# Altium project obc_ver111.PrjPcb (part 2 of 2)

## Sheet obc-v2_MCU-POWER.SchDoc
size 420 x 297 mm; SheetNumber: 20; SheetTotal: 21
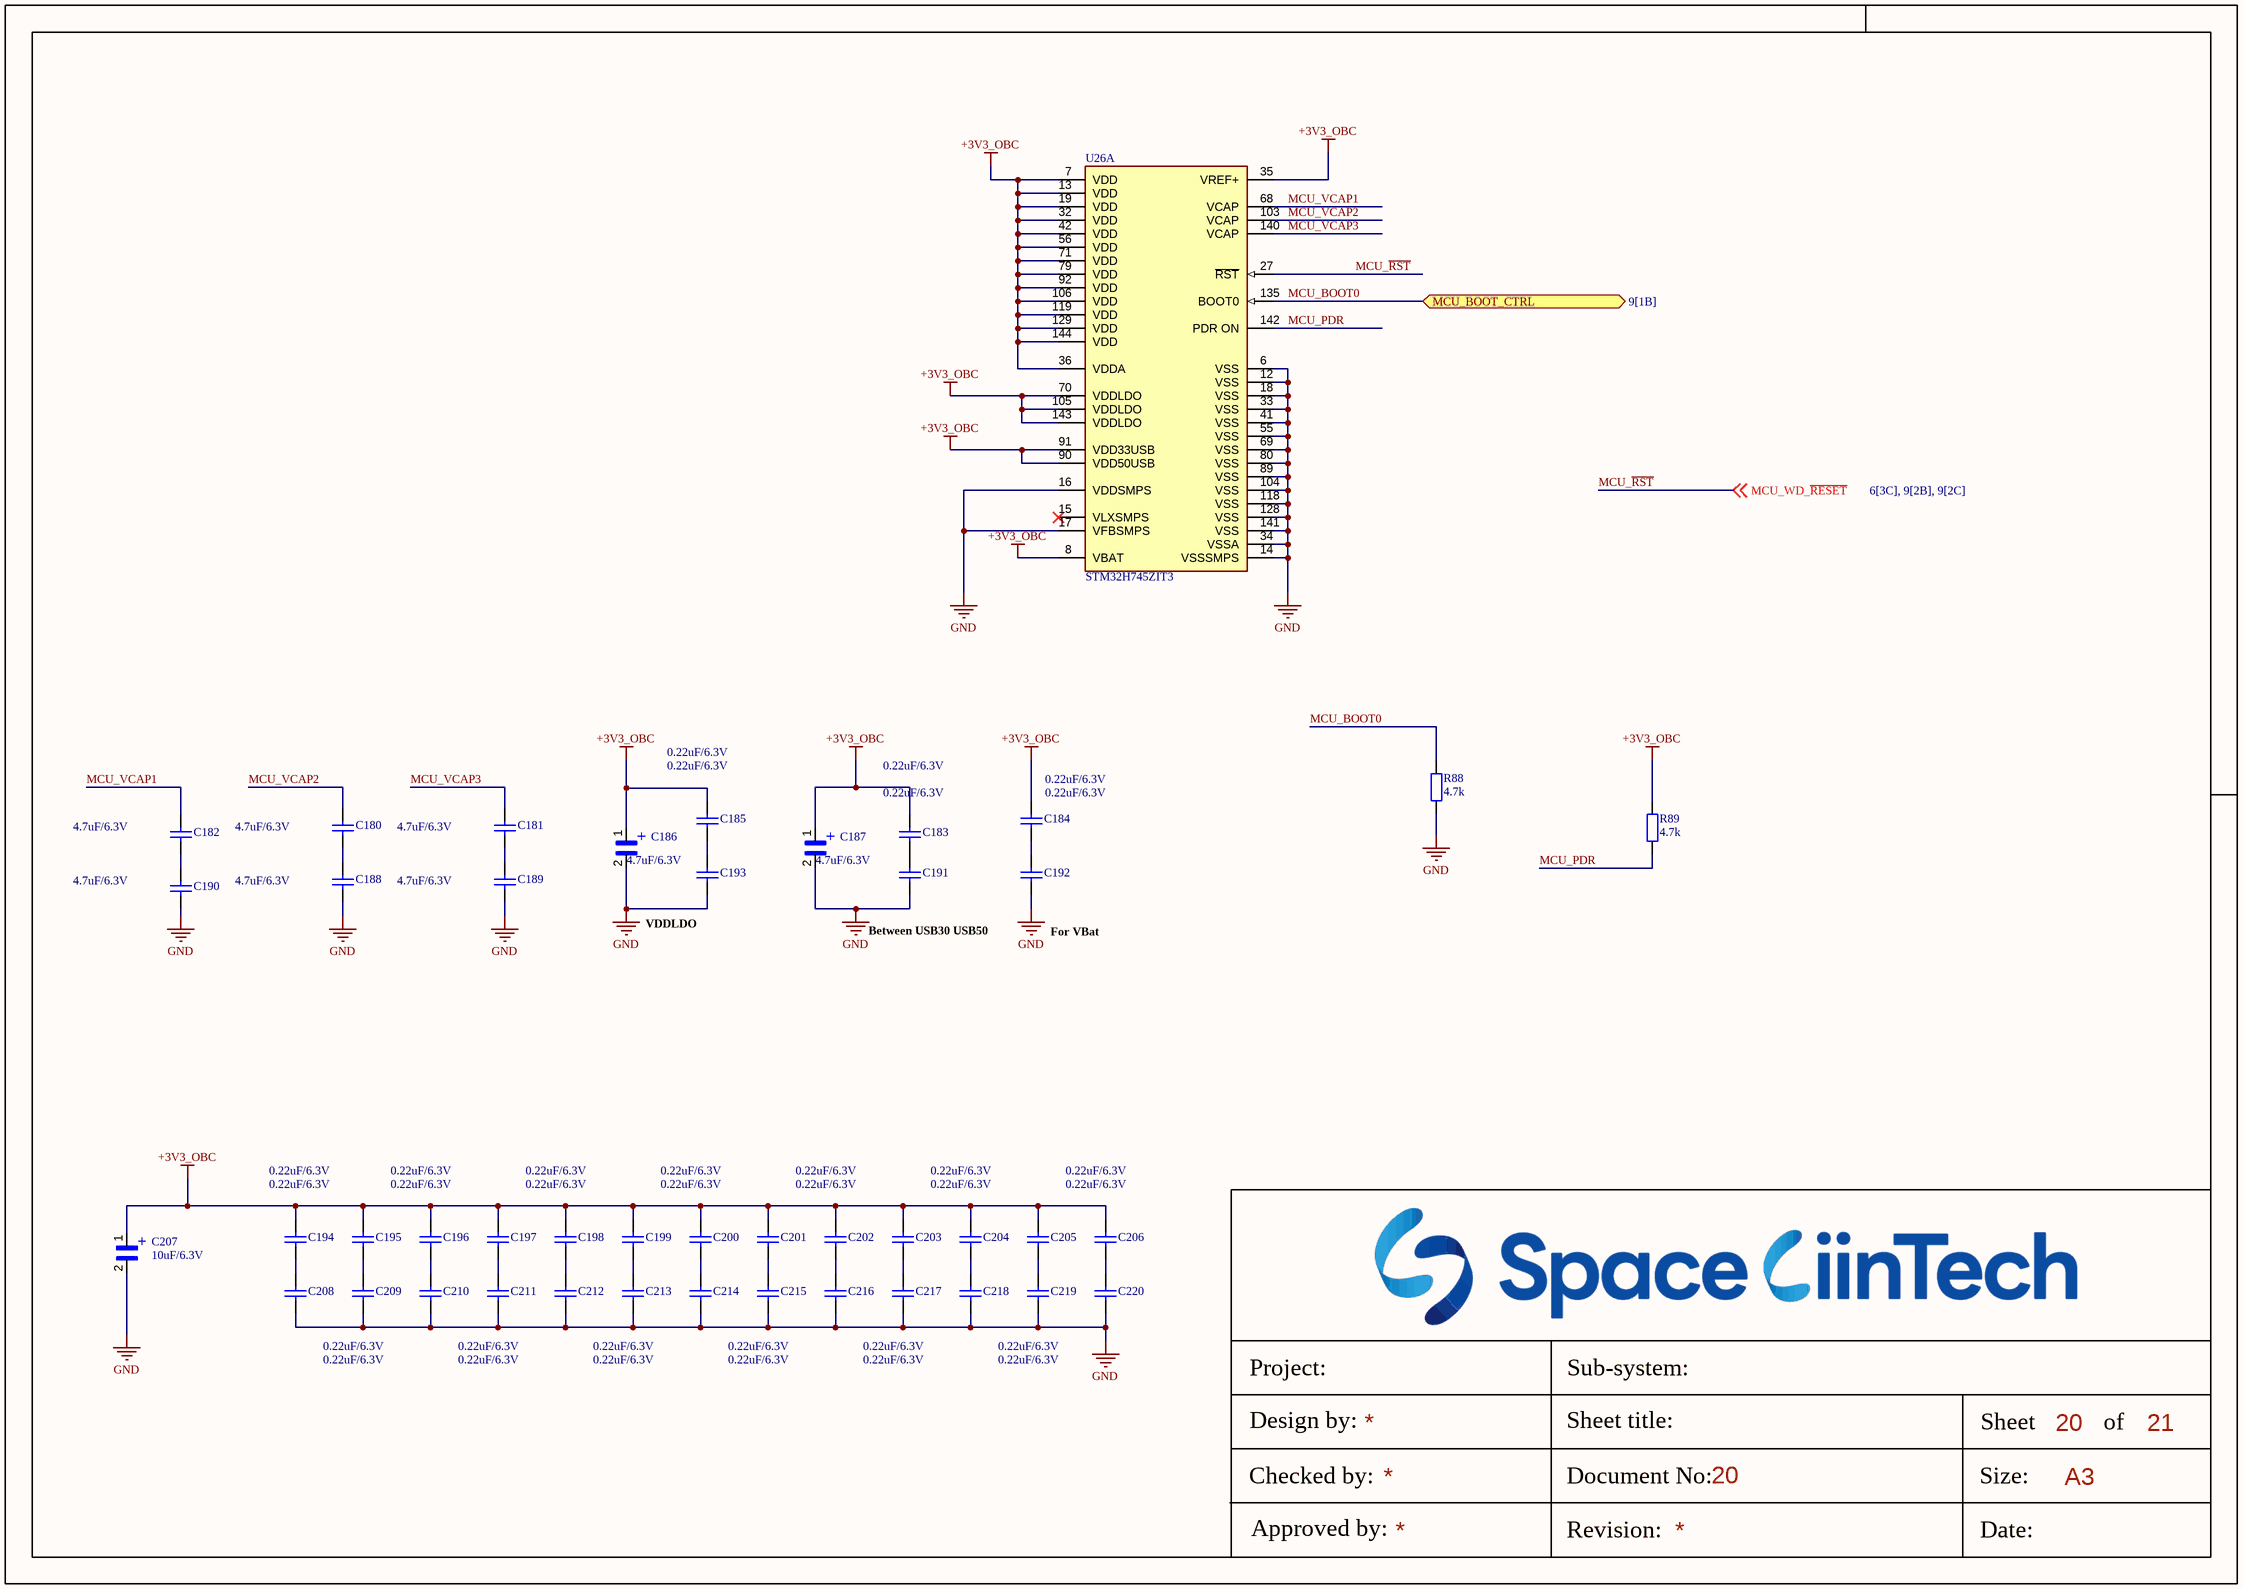
[diagram p12: obc-v2_MCU-POWER.SchDoc]

### Parts
C180  4.7uF/6.3V  [CAP_C_1005X60]
C181  4.7uF/6.3V  [CAP_C_1005X60]
C182  4.7uF/6.3V  [CAP_C_1005X60]
C183  0.22uF/6.3V  [CAP_C_1005X60]
C184  0.22uF/6.3V  [CAP_C_1005X60]
C185  0.22uF/6.3V  [CAP_C_1005X60]
C186  4.7uF/6.3V  [CAP_MP_1608X90]
C187  4.7uF/6.3V  [CAP_MP_1608X90]
C188  4.7uF/6.3V  [CAP_C_1005X60]
C189  4.7uF/6.3V  [CAP_C_1005X60]
C190  4.7uF/6.3V  [CAP_C_1005X60]
C191  0.22uF/6.3V  [CAP_C_1005X60]
C192  0.22uF/6.3V  [CAP_C_1005X60]
C193  0.22uF/6.3V  [CAP_C_1005X60]
C194  0.22uF/6.3V  [CAP_C_1005X60]
C195  0.22uF/6.3V  [CAP_C_1005X60]
C196  0.22uF/6.3V  [CAP_C_1005X60]
C197  0.22uF/6.3V  [CAP_C_1005X60]
C198  0.22uF/6.3V  [CAP_C_1005X60]
C199  0.22uF/6.3V  [CAP_C_1005X60]
C200  0.22uF/6.3V  [CAP_C_1005X60]
C201  0.22uF/6.3V  [CAP_C_1005X60]
C202  0.22uF/6.3V  [CAP_C_1005X60]
C203  0.22uF/6.3V  [CAP_C_1005X60]
C204  0.22uF/6.3V  [CAP_C_1005X60]
C205  0.22uF/6.3V  [CAP_C_1005X60]
C206  0.22uF/6.3V  [CAP_C_1005X60]
C207  10uF/6.3V  [CAP_MP_2012X170]
C208  0.22uF/6.3V  [CAP_C_1005X60]
C209  0.22uF/6.3V  [CAP_C_1005X60]
C210  0.22uF/6.3V  [CAP_C_1005X60]
C211  0.22uF/6.3V  [CAP_C_1005X60]
C212  0.22uF/6.3V  [CAP_C_1005X60]
C213  0.22uF/6.3V  [CAP_C_1005X60]
C214  0.22uF/6.3V  [CAP_C_1005X60]
C215  0.22uF/6.3V  [CAP_C_1005X60]
C216  0.22uF/6.3V  [CAP_C_1005X60]
C217  0.22uF/6.3V  [CAP_C_1005X60]
C218  0.22uF/6.3V  [CAP_C_1005X60]
C219  0.22uF/6.3V  [CAP_C_1005X60]
C220  0.22uF/6.3V  [CAP_C_1005X60]
R88  4.7k  [RES_C_1608X60]
R89  4.7k  [RES_C_1608X60]
U26  STM32H745ZIT3  [FP-LQFP144-1A-MFG]  (part A of 3)

### Ports
MCU_BOOT_CTRL (bidir, see 9[1B])

### Nets
+3V3_OBC: C183.1 C184.1 C185.1 C186.1 C187.1 C194.1 C195.1 C196.1 C197.1 C198.1 C199.1 C200.1 C201.1 C202.1 C203.1 C204.1 C205.1 C206.1 C207.1 R89.1 U26.7(VDD) U26.8(VBAT) U26.13(VDD) U26.19(VDD) U26.32(VDD) U26.35(VREF+) U26.36(VDDA) U26.42(VDD) U26.56(VDD) U26.70(VDDLDO) U26.71(VDD) U26.79(VDD) U26.90(VDD50USB) U26.91(VDD33USB) U26.92(VDD) U26.105(VDDLDO) U26.106(VDD) U26.119(VDD) U26.129(VDD) U26.143(VDDLDO) U26.144(VDD)
GND: C186.2 C187.2 C188.2 C189.2 C190.2 C191.2 C192.2 C193.2 C207.2 C208.2 C209.2 C210.2 C211.2 C212.2 C213.2 C214.2 C215.2 C216.2 C217.2 C218.2 C219.2 C220.2 R88.1 U26.6(VSS) U26.12(VSS) U26.14(VSSSMPS) U26.16(VDDSMPS) U26.17(VFBSMPS) U26.18(VSS) U26.33(VSS) U26.34(VSSA) U26.41(VSS) U26.55(VSS) U26.69(VSS) U26.80(VSS) U26.89(VSS) U26.104(VSS) U26.118(VSS) U26.128(VSS) U26.141(VSS)
MCU_BOOT0: R88.2 U26.135(BOOT0) ; port MCU_BOOT_CTRL
MCU_PDR: R89.2 U26.142(PDR_ON)
MCU_~{RST}: U26.27(~{RST}) ; off-sheet MCU_WD_~{RESET}  [also labelled MCU_WD_~{RESET}]
MCU_VCAP1: C182.1 U26.68(VCAP)
MCU_VCAP2: C180.1 U26.103(VCAP)
MCU_VCAP3: C181.1 U26.140(VCAP)
NetC180_2: C180.2 C188.1
NetC181_2: C181.2 C189.1
NetC182_2: C182.2 C190.1
NetC183_2: C183.2 C191.1
NetC184_2: C184.2 C192.1
NetC185_2: C185.2 C193.1
NetC194_2: C194.2 C208.1
NetC195_2: C195.2 C209.1
NetC196_2: C196.2 C210.1
NetC197_2: C197.2 C211.1
NetC198_2: C198.2 C212.1
NetC199_2: C199.2 C213.1
NetC200_2: C200.2 C214.1
NetC201_2: C201.2 C215.1
NetC202_2: C202.2 C216.1
NetC203_2: C203.2 C217.1
NetC204_2: C204.2 C218.1
NetC205_2: C205.2 C219.1
NetC206_2: C206.2 C220.1

Not connected (* = marked no-connect by the designer): U26 15(VLXSMPS)*

### Notes on the sheet
- VDDLDO
- Between USB30 USB50
- (near C192) For VBat
- Project:
- Sub-system:
- Design by:
- Sheet title:
- Sheet
- A3
- of
- Checked by:
- Approved by:
- Revision:
- Document No:
- Size:
- Date:
- (in symbol TACL335M003RTA) +
- (in symbol TACR686M003RTA) +

### Library data of the parts
C180-C182 C185 C188-C190 C193 = Tu 0402 33nF 10V: 4.7 µF ±20% 6.3V Ceramic Capacitor X7T 0402 (1005 Metric): GRT155D70J475ME13J; Chung_Loai: Dán; Don_Vi: Con; So_Chan: 2; Ten_Linh_Kien: Tụ 0402 33nF X7R 10V GRM155R71A333KA01D; Ma_Hang: MH007853; Kieu_Chan: *
C183 C184 C191 C192 C194-C206 C208-C220 = Tu 0402 33nF 10V: CAPC; Chung_Loai: Dán; Don_Vi: Con; So_Chan: 2; Ten_Linh_Kien: Tụ 0402 33nF X7R 10V GRM155R71A333KA01D; Ma_Hang: MH007853; Kieu_Chan: *
C186 C187 = TACL335M003RTA: CAPP; Package: None; Price: None; Value: *; MP: TACL335M003RTA; Availability: Unavailable
C207 = TACR686M003RTA: CAPP; MF: AVX; Availability: Unavailable; SnapEDA_Link: https://www.snapeda.com/parts/TACR686M003RTA/AVX/view-part/1745975/?ref=snap; MP: TACR686M003RTA; Value: *; Price: None; Package: 0805 AVX
R88 R89 = Tro 0603 1% 10k: RES; Chung_Loai: Dán; Don_Vi: Con; So_Chan: 2; Ten_Linh_Kien: Trở 0603 1% 10k; Ma_Hang: MH006333; Kieu_Chan: *
U26 = CMP-12105-000054-1: HIGH-PERFORMANCE AND DSP WITH DP; Manufacturer Part Number: STM32H745ZIT6; Manufacturer: STMicroelectronics; Number Of Timers/Counters: 20; Min Supply Voltage: 1.62V; Frequency: 480MHz; Number Of I2C Channels: 4; Memory Type: FLASH; Number Of I/Os: 97; Number Of Pwm Channels: 42; Number Of Usb Channels: 2; Ram Size: 1MBytes; Memory Size: 2MBytes; Data Bus Width: 32bits; Number Of Adc Channels: 23; Number Of Ethernet Channels: 1; Number Of Uart Channels: 9; Interface: I2C,SPI,UART,USART,CAN,USB,LIN,IrDA,Ethernet,I2S,Other; Number Of A/D Converters: 3; Max Junction Temp: +125°C; Max Supply Voltage: 3.6V; Core Architecture: ARM Cortex-M4, Cortex-M7; Number Of Spi Channels: 6; Standoff Height: 0.05mm; Ambient Temperature Range Low: -40°C; Lead Free: Yes; Automotive: No; Height: 1.6mm; Device Class L1: Integrated Circuits (ICs); Ambient Temperature Range High: +85°C; RoHS: TRUE; Temperature Range High: +125°C; Temperature: -40°C to +125°C; Category: IC; Device Class L2: Embedded Processors and Controllers; Number Of Cores: 2; Temperature Range Low: -40°C; Octopart: https://octopart.com/stm32h745zit6-stmicroelectronics-100293939; Digikey Description: HIGH-PERFORMANCE AND DSP WITH DP; Package: LQFP144-1A; Device Class L3: Microcontrollers; ComponentLink2URL: https://www.st.com/resource/en/datasheet/stm32h745zi.pdf; ComponentLink2Description: Datasheet

## Sheet obc-v2_MCU-PinOut.SchDoc
size 420 x 297 mm; SheetNumber: 21; SheetTotal: 21
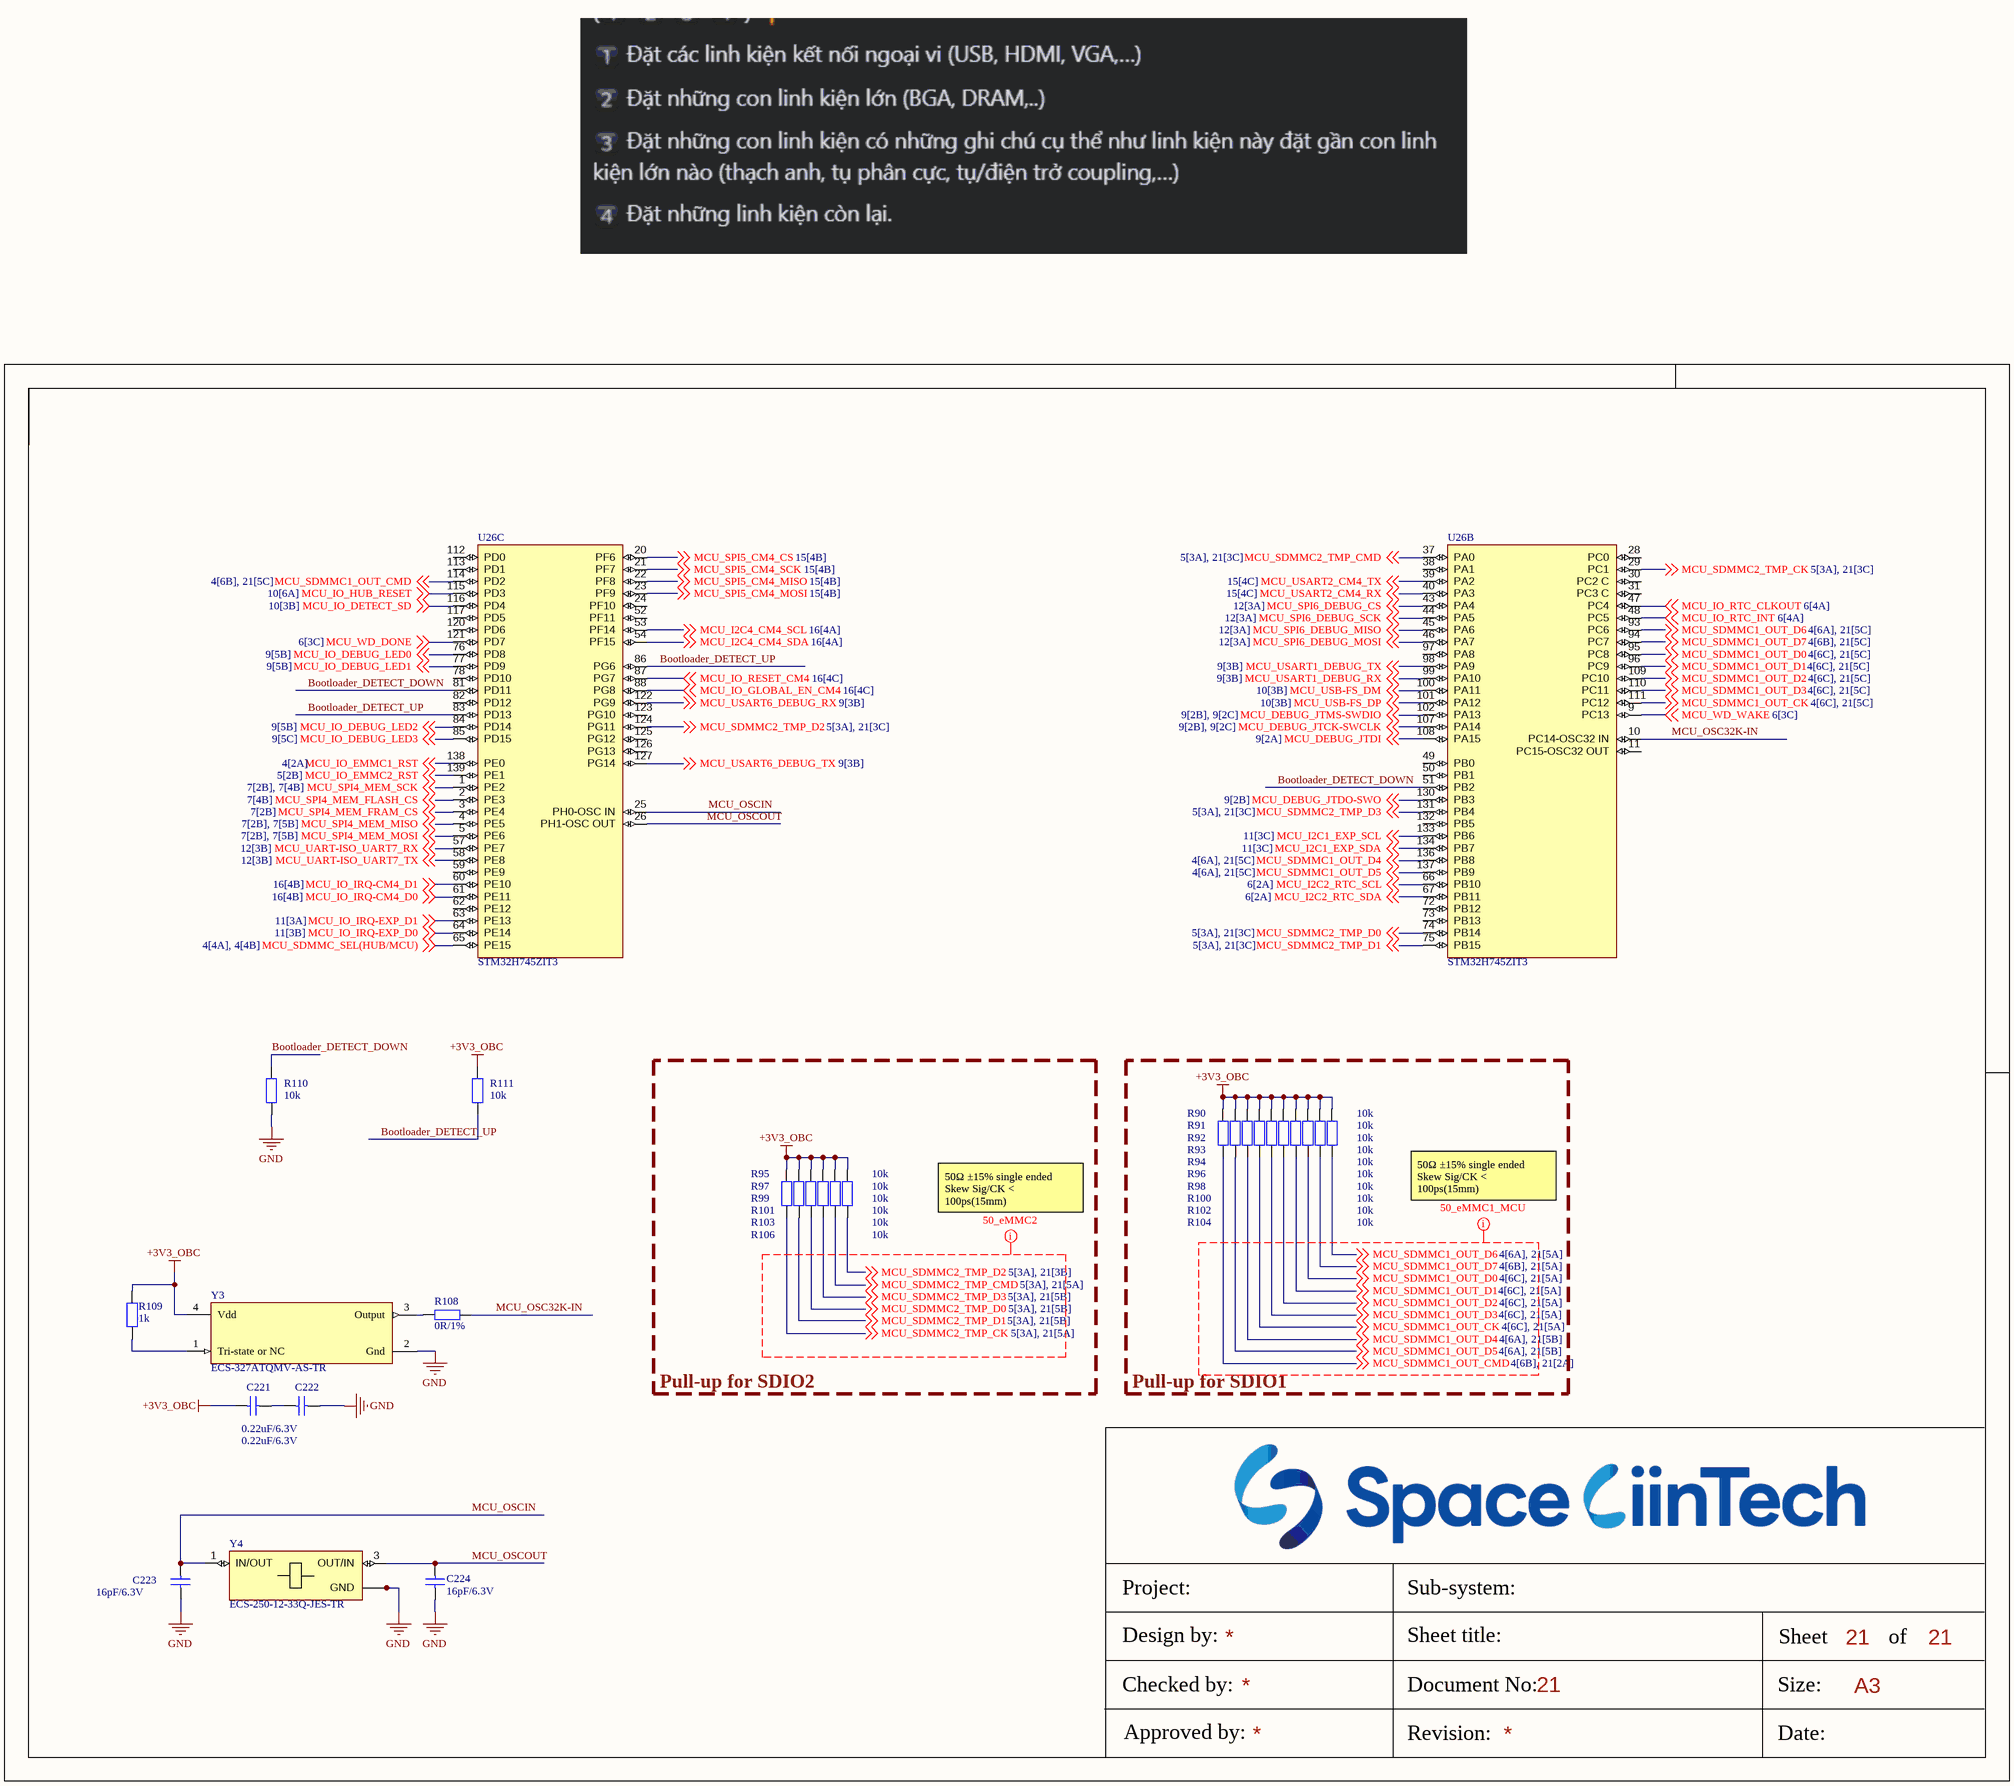
[diagram p13: obc-v2_MCU-PinOut.SchDoc]

### Parts
C221  0.22uF/6.3V  [CAP_C_1005X60]
C222  0.22uF/6.3V  [CAP_C_1005X60]
C223  16pF/6.3V  [CAP_C_1005X60]
C224  16pF/6.3V  [CAP_C_1005X60]
R90  10k  [RES_C_1608X60]
R91  10k  [RES_C_1608X60]
R92  10k  [RES_C_1608X60]
R93  10k  [RES_C_1608X60]
R94  10k  [RES_C_1608X60]
R95  10k  [RES_C_1608X60]
R96  10k  [RES_C_1608X60]
R97  10k  [RES_C_1608X60]
R98  10k  [RES_C_1608X60]
R99  10k  [RES_C_1608X60]
R100  10k  [RES_C_1608X60]
R101  10k  [RES_C_1608X60]
R102  10k  [RES_C_1608X60]
R103  10k  [RES_C_1608X60]
R104  10k  [RES_C_1608X60]
R106  10k  [RES_C_1608X60]
R108  0R/1%  [RES_C_1608X60]
R109  1k  [RES_C_1608X60]
R110  10k  [RES_C_1608X60]
R111  10k  [RES_C_1608X60]
U26  STM32H745ZIT3  [FP-LQFP144-1A-MFG]  (parts B,C of 3)
Y3  ECS-327ATQMV-AS-TR  [FP-327ATQMV-MFG]
Y4  ECS-250-12-33Q-JES-TR  [XTAL_ECS-250-12-33Q-JES-TR]

### Blocks framed on the sheet
Pull-up for SDIO2: R95 R97 R99 R101 R103 R106
Pull-up for SDIO1: R90-R94 R96 R98 R100 R102 R104

### Nets
+3V3_OBC: C221.1 R90.2 R91.2 R92.2 R93.2 R94.2 R95.2 R96.2 R97.2 R98.2 R99.2 R100.2 R101.2 R102.2 R103.2 R104.2 R106.2 R109.1 R111.2 Y3.4(Vdd)
GND: C222.2 C223.1 C224.1 R110.1 Y3.2(Gnd) Y4.2(GND) Y4.4(GND)
Bootloader_DETECT_DOWN: R110.2 U26.51(PB2) U26.81(PD11)
Bootloader_DETECT_UP: R111.1 U26.83(PD13) U26.86(PG6)
MCU_DEBUG_JTCK-SWCLK: U26.107(PA14) ; off-sheet MCU_DEBUG_JTCK-SWCLK
MCU_DEBUG_JTDI: U26.108(PA15) ; off-sheet MCU_DEBUG_JTDI
MCU_DEBUG_JTDO-SWO: U26.130(PB3) ; off-sheet MCU_DEBUG_JTDO-SWO
MCU_DEBUG_JTMS-SWDIO: U26.102(PA13) ; off-sheet MCU_DEBUG_JTMS-SWDIO
MCU_I2C1_EXP_SCL: U26.133(PB6) ; off-sheet MCU_I2C1_EXP_SCL
MCU_I2C1_EXP_SDA: U26.134(PB7) ; off-sheet MCU_I2C1_EXP_SDA
MCU_I2C2_RTC_SCL: U26.66(PB10) ; off-sheet MCU_I2C2_RTC_SCL
MCU_I2C2_RTC_SDA: U26.67(PB11) ; off-sheet MCU_I2C2_RTC_SDA
MCU_I2C4_CM4_SCL: U26.53(PF14) ; off-sheet MCU_I2C4_CM4_SCL
MCU_I2C4_CM4_SDA: U26.54(PF15) ; off-sheet MCU_I2C4_CM4_SDA
MCU_IO_DEBUG_LED0: U26.76(PD8) ; off-sheet MCU_IO_DEBUG_LED0
MCU_IO_DEBUG_LED1: U26.77(PD9) ; off-sheet MCU_IO_DEBUG_LED1
MCU_IO_DEBUG_LED2: U26.84(PD14) ; off-sheet MCU_IO_DEBUG_LED2
MCU_IO_DEBUG_LED3: U26.85(PD15) ; off-sheet MCU_IO_DEBUG_LED3
MCU_IO_DETECT_SD: U26.116(PD4) ; off-sheet MCU_IO_DETECT_SD
MCU_IO_EMMC1_RST: U26.138(PE0) ; off-sheet MCU_IO_EMMC1_RST
MCU_IO_EMMC2_RST: U26.139(PE1) ; off-sheet MCU_IO_EMMC2_RST
MCU_IO_GLOBAL_EN_CM4: U26.88(PG8) ; off-sheet MCU_IO_GLOBAL_EN_CM4
MCU_IO_HUB_RESET: U26.115(PD3) ; off-sheet MCU_IO_HUB_RESET
MCU_IO_IRQ-CM4_D0: U26.61(PE11) ; off-sheet MCU_IO_IRQ-CM4_D0
MCU_IO_IRQ-CM4_D1: U26.60(PE10) ; off-sheet MCU_IO_IRQ-CM4_D1
MCU_IO_IRQ-EXP_D0: U26.64(PE14) ; off-sheet MCU_IO_IRQ-EXP_D0
MCU_IO_IRQ-EXP_D1: U26.63(PE13) ; off-sheet MCU_IO_IRQ-EXP_D1
MCU_IO_RESET_CM4: U26.87(PG7) ; off-sheet MCU_IO_RESET_CM4
MCU_IO_RTC_CLKOUT: U26.47(PC4) ; off-sheet MCU_IO_RTC_CLKOUT
MCU_IO_RTC_INT: U26.48(PC5) ; off-sheet MCU_IO_RTC_INT
MCU_OSC32K-IN: R108.1 U26.10(PC14-OSC32_IN)
MCU_OSCIN: C223.2 U26.25(PH0-OSC_IN) Y4.1(IN/OUT)
MCU_OSCOUT: C224.2 U26.26(PH1-OSC_OUT) Y4.3(OUT/IN)
MCU_SDMMC1_OUT_CK: R93.1 U26.111(PC12) ; off-sheet MCU_SDMMC1_OUT_CK
MCU_SDMMC1_OUT_CMD: R90.1 U26.114(PD2) ; off-sheet MCU_SDMMC1_OUT_CMD
MCU_SDMMC1_OUT_D0: R100.1 U26.95(PC8) ; off-sheet MCU_SDMMC1_OUT_D0
MCU_SDMMC1_OUT_D1: R98.1 U26.96(PC9) ; off-sheet MCU_SDMMC1_OUT_D1
MCU_SDMMC1_OUT_D2: R96.1 U26.109(PC10) ; off-sheet MCU_SDMMC1_OUT_D2
MCU_SDMMC1_OUT_D3: R94.1 U26.110(PC11) ; off-sheet MCU_SDMMC1_OUT_D3
MCU_SDMMC1_OUT_D4: R92.1 U26.136(PB8) ; off-sheet MCU_SDMMC1_OUT_D4
MCU_SDMMC1_OUT_D5: R91.1 U26.137(PB9) ; off-sheet MCU_SDMMC1_OUT_D5
MCU_SDMMC1_OUT_D6: R104.1 U26.93(PC6) ; off-sheet MCU_SDMMC1_OUT_D6
MCU_SDMMC1_OUT_D7: R102.1 U26.94(PC7) ; off-sheet MCU_SDMMC1_OUT_D7
MCU_SDMMC2_TMP_CK: R95.1 U26.29(PC1) ; off-sheet MCU_SDMMC2_TMP_CK
MCU_SDMMC2_TMP_CMD: R103.1 U26.37(PA0) ; off-sheet MCU_SDMMC2_TMP_CMD
MCU_SDMMC2_TMP_D0: R99.1 U26.74(PB14) ; off-sheet MCU_SDMMC2_TMP_D0
MCU_SDMMC2_TMP_D1: R97.1 U26.75(PB15) ; off-sheet MCU_SDMMC2_TMP_D1
MCU_SDMMC2_TMP_D2: R106.1 U26.124(PG11) ; off-sheet MCU_SDMMC2_TMP_D2
MCU_SDMMC2_TMP_D3: R101.1 U26.131(PB4) ; off-sheet MCU_SDMMC2_TMP_D3
MCU_SDMMC_SEL(HUB/MCU): U26.65(PE15) ; off-sheet MCU_SDMMC_SEL(HUB/MCU)
MCU_SPI4_MEM_FLASH_CS: U26.2(PE3) ; off-sheet MCU_SPI4_MEM_FLASH_CS
MCU_SPI4_MEM_FRAM_CS: U26.3(PE4) ; off-sheet MCU_SPI4_MEM_FRAM_CS
MCU_SPI4_MEM_MISO: U26.4(PE5) ; off-sheet MCU_SPI4_MEM_MISO
MCU_SPI4_MEM_MOSI: U26.5(PE6) ; off-sheet MCU_SPI4_MEM_MOSI
MCU_SPI4_MEM_SCK: U26.1(PE2) ; off-sheet MCU_SPI4_MEM_SCK
MCU_SPI5_CM4_CS: U26.20(PF6) ; off-sheet MCU_SPI5_CM4_CS
MCU_SPI5_CM4_MISO: U26.22(PF8) ; off-sheet MCU_SPI5_CM4_MISO
MCU_SPI5_CM4_MOSI: U26.23(PF9) ; off-sheet MCU_SPI5_CM4_MOSI
MCU_SPI5_CM4_SCK: U26.21(PF7) ; off-sheet MCU_SPI5_CM4_SCK
MCU_SPI6_DEBUG_CS: U26.43(PA4) ; off-sheet MCU_SPI6_DEBUG_CS
MCU_SPI6_DEBUG_MISO: U26.45(PA6) ; off-sheet MCU_SPI6_DEBUG_MISO
MCU_SPI6_DEBUG_MOSI: U26.46(PA7) ; off-sheet MCU_SPI6_DEBUG_MOSI
MCU_SPI6_DEBUG_SCK: U26.44(PA5) ; off-sheet MCU_SPI6_DEBUG_SCK
MCU_UART-ISO_UART7_RX: U26.57(PE7) ; off-sheet MCU_UART-ISO_UART7_RX
MCU_UART-ISO_UART7_TX: U26.58(PE8) ; off-sheet MCU_UART-ISO_UART7_TX
MCU_USART1_DEBUG_RX: U26.99(PA10) ; off-sheet MCU_USART1_DEBUG_RX
MCU_USART1_DEBUG_TX: U26.98(PA9) ; off-sheet MCU_USART1_DEBUG_TX
MCU_USART2_CM4_RX: U26.40(PA3) ; off-sheet MCU_USART2_CM4_RX
MCU_USART2_CM4_TX: U26.39(PA2) ; off-sheet MCU_USART2_CM4_TX
MCU_USART6_DEBUG_RX: U26.122(PG9) ; off-sheet MCU_USART6_DEBUG_RX
MCU_USART6_DEBUG_TX: U26.127(PG14) ; off-sheet MCU_USART6_DEBUG_TX
MCU_USB-FS_DM: U26.100(PA11) ; off-sheet MCU_USB-FS_DM
MCU_USB-FS_DP: U26.101(PA12) ; off-sheet MCU_USB-FS_DP
MCU_WD_DONE: U26.121(PD7) ; off-sheet MCU_WD_DONE
MCU_WD_WAKE: U26.9(PC13) ; off-sheet MCU_WD_WAKE
NetC221_2: C221.2 C222.1
NetR108_2: R108.2 Y3.3(Output)
NetR109_2: R109.2 Y3.1(Tri-state_or_NC)

Not connected (* = marked no-connect by the designer): U26 11(PC15-OSC32_OUT) 24(PF10) 28(PC0) 30(PC2_C) 31(PC3_C) 38(PA1) 49(PB0) 50(PB1) 52(PF11) 59(PE9) 62(PE12) 72(PB12) 73(PB13) 78(PD10) 82(PD12) 97(PA8) 112(PD0) 113(PD1) 117(PD5) 120(PD6) 123(PG10) 125(PG12) 126(PG13) 132(PB5)

### Layout directives
net class 50_eMMC1_MCU: MCU_SDMMC1_OUT_CK, MCU_SDMMC1_OUT_CMD, MCU_SDMMC1_OUT_D0, MCU_SDMMC1_OUT_D1, MCU_SDMMC1_OUT_D2, MCU_SDMMC1_OUT_D3, MCU_SDMMC1_OUT_D4, MCU_SDMMC1_OUT_D5, MCU_SDMMC1_OUT_D6, MCU_SDMMC1_OUT_D7
net class 50_eMMC2: MCU_SDMMC2_TMP_CK, MCU_SDMMC2_TMP_CMD, MCU_SDMMC2_TMP_D0, MCU_SDMMC2_TMP_D1, MCU_SDMMC2_TMP_D2, MCU_SDMMC2_TMP_D3

### Notes on the sheet
- 50Ω ±15% single ended
  Skew Sig/CK < 100ps(15mm)
  Max Length 100mm
- Project:
- Sub-system:
- Design by:
- Sheet title:
- Sheet
- A3
- of
- Checked by:
- Approved by:
- Revision:
- Document No:
- Size:
- Date:

### Library data of the parts
C221-C224 = Tu 0402 33nF 10V: as C183 on sheet obc-v2_MCU-POWER; Kieu_Chan: *
R90-R104 R106 R110 R111 = Tro 0603 1% 10k: RES 4.7K OHM 1% 1/10W 0603, P/N: ERJ-U03F4701V; Chung_Loai: Dán; Don_Vi: Con; So_Chan: 2; Ten_Linh_Kien: Trở 0603 1% 10k; Ma_Hang: MH006333; Kieu_Chan: *
R108 R109 = Tro 0603 1% 10k: as R88 on sheet obc-v2_MCU-POWER; Kieu_Chan: *
U26 = CMP-12105-000054-1: as U26 on sheet obc-v2_MCU-POWER; Ambient Temperature Range Low: -40°C; Lead Free: Yes; Automotive: No; Height: 1.6mm; Device Class L1: Integrated Circuits (ICs); Ambient Temperature Range High: +85°C; RoHS: TRUE; Temperature Range High: +125°C; Temperature: -40°C to +125°C; Category: IC; Device Class L2: Embedded Processors and Controllers; Number Of Cores: 2; Temperature Range Low: -40°C; Octopart: https://octopart.com/stm32h745zit6-stmicroelectronics-100293939; Digikey Description: HIGH-PERFORMANCE AND DSP WITH DP; Package: LQFP144-1A; Device Class L3: Microcontrollers; ComponentLink2URL: https://www.st.com/resource/en/datasheet/stm32h745zi.pdf; ComponentLink2Description: Datasheet
Y3 = CMP-40224-000027-1: XTAL OSC XO 32.7680KHZ CMOS SMD; RoHS Compliant: Yes
Y4 = ECS-250-12-33Q-JES-TR: 25 MHz Â±20ppm Crystal 12pF 40 Ohms 4-SMD, No Lead; MF: ECS Inc.; Value: *; Purchase-URL: https://pricing.snapeda.com/search/part/ECS-250-12-33Q-JES-TR/?ref=eda; Package: ECS-33B ECS Inc.; Availability: In Stock; SnapEDA_Link: https://www.snapeda.com/parts/ECS-250-12-33Q-JES-TR/ECS+Inc./view-part/?ref=snap; MP: ECS-250-12-33Q-JES-TR; Check_prices: https://www.snapeda.com/parts/ECS-250-12-33Q-JES-TR/ECS+Inc./view-part/?ref=eda; Price: None

## Nets that join several sheets
+3.3V_EXP-ISO: obc-v2_BOARD-CONNECT (J3.9), obc-v2_EXP-I2C-IRQ (9 pins), obc-v2_EXP-CAN-RS422 (6 pins)
+3V3_CM4: obc-v2_POWER (C12.1 R3.2 U3.4 U3.5), obc-v2_CM4-PinOut (10 pins), obc-v2_CM4-SPI-UART (7 pins), obc-v2_CM4-IRQ-CTRL (12 pins), obc-v2_CM4-FUNCTION (D16.2 D17.2)
+3V3_M2: obc-v2_POWER (C7.1 D2.2 U2.2 U2.4), obc-v2_CM4-M2 (16 pins)
+3V3_OBC: obc-v2_POWER (5 pins), obc-v2_RTC-WDOG (11 pins), obc-v2_DEBUG (J6.1 J7.7), obc-v2_EXP-I2C-IRQ (8 pins), obc-v2_EXP-CAN-RS422 (8 pins), obc-v2_CM4-PinOut (5 pins), obc-v2_CM4-SPI-UART (6 pins), obc-v2_CM4-IRQ-CTRL (12 pins), obc-v2_MCU-POWER (41 pins), obc-v2_MCU-PinOut (20 pins)
+5V_AUX-Adaptor: obc-v2_POWER (8 pins), obc-v2_BOARD-CONNECT (J3.21 J18.05 J18.07), obc-v2_CM4-PinOut (J20.2)
+5V_USB-Adaptor: obc-v2_POWER (5 pins), obc-v2_BOARD-CONNECT (C69.2 D5.5 J4.1 J18.03)
GND: obc-v2_POWER (7 pins), obc-v2_RTC-WDOG (11 pins), obc-v2_BOARD-CONNECT (C70.1 D5.2 J4.5 J18.04), obc-v2_DEBUG (12 pins), obc-v2_EXP-I2C-IRQ (C106.2 C110.2 U15.4 U16.4), obc-v2_EXP-CAN-RS422 (6 pins), obc-v2_CM4-PinOut (5 pins), obc-v2_CM4-SPI-UART (5 pins), obc-v2_CM4-IRQ-CTRL (6 pins), obc-v2_MCU-POWER (40 pins), obc-v2_MCU-PinOut (7 pins)
GND_CM4: obc-v2_POWER (12 pins), obc-v2_BOARD-CONNECT (11 pins), obc-v2_CM4-M2 (23 pins), obc-v2_CM4-PinOut (18 pins), obc-v2_CM4-SPI-UART (5 pins), obc-v2_CM4-IRQ-CTRL (6 pins), obc-v2_CM4-FUNCTION (7 pins)
GND_EXP: obc-v2_BOARD-CONNECT (6 pins), obc-v2_EXP-I2C-IRQ (5 pins), obc-v2_EXP-CAN-RS422 (6 pins)
CM4_ENABLE: obc-v2_CM4-IRQ-CTRL (R55.2), obc-v2_CM4-FUNCTION (J23.1 R81.2)
CM4_I2C4_ToCAM_SCL: obc-v2_BOARD-CONNECT (J3.20), obc-v2_CM4-PinOut (CM4.37)
CM4_I2C4_ToCAM_SDA: obc-v2_BOARD-CONNECT (J3.41), obc-v2_CM4-PinOut (CM4.30)
CM4_I2CSlave_ToOBC_SCL: obc-v2_CM4-PinOut (CM4.38), obc-v2_CM4-IRQ-CTRL (R71.1 U27.3)
CM4_I2CSlave_ToOBC_SDA: obc-v2_CM4-PinOut (CM4.44), obc-v2_CM4-IRQ-CTRL (R73.1 U27.2)
CM4_IO_ToCAM_CAMIO1: obc-v2_BOARD-CONNECT (J3.16), obc-v2_CM4-PinOut (CM4.24)
CM4_IO_ToOBC_IRQ0: obc-v2_CM4-PinOut (CM4.45), obc-v2_CM4-IRQ-CTRL (R77.1 U24.2)
CM4_IO_ToOBC_IRQ1: obc-v2_CM4-PinOut (CM4.40), obc-v2_CM4-IRQ-CTRL (R75.1 U24.3)
CM4_RESET: obc-v2_CM4-IRQ-CTRL (R51.1 U25.3), obc-v2_CM4-FUNCTION (J27.1 R84.2)
CM4_SPI1_ISO_CS: obc-v2_CM4-PinOut (CM4.49), obc-v2_CM4-SPI-UART (R70.1 U22.5)
CM4_SPI1_ISO_MISO: obc-v2_CM4-PinOut (CM4.26), obc-v2_CM4-SPI-UART (R52.1 U22.6)
CM4_SPI1_ISO_MOSI: obc-v2_CM4-PinOut (CM4.27), obc-v2_CM4-SPI-UART (U22.4)
CM4_SPI1_ISO_SCK: obc-v2_CM4-PinOut (CM4.25), obc-v2_CM4-SPI-UART (U22.3)
CM4_UART3_ToOBC_RX: obc-v2_CM4-PinOut (CM4.34), obc-v2_CM4-SPI-UART (U23.2)
CM4_UART3_ToOBC_TX: obc-v2_CM4-PinOut (CM4.54), obc-v2_CM4-SPI-UART (U23.3)
EDGE-PLATING: obc-v2_BOARD-CONNECT (J3.19 J3.40 J18.09 J18.10), obc-v2_DEBUG (H1.1 H2.1 H3.1 H4.1)
MCU_BOOT0: obc-v2_DEBUG (J7.1), obc-v2_MCU-POWER (R88.2 U26.135)
MCU_DEBUG_JTCK-SWCLK: obc-v2_DEBUG (J6.5 J7.4), obc-v2_MCU-PinOut (U26.107)
MCU_DEBUG_JTDI: obc-v2_DEBUG (J6.3), obc-v2_MCU-PinOut (U26.108)
MCU_DEBUG_JTDO-SWO: obc-v2_DEBUG (J6.6), obc-v2_MCU-PinOut (U26.130)
MCU_DEBUG_JTMS-SWDIO: obc-v2_DEBUG (J6.4 J7.5), obc-v2_MCU-PinOut (U26.102)
MCU_I2C1_EXP_SCL: obc-v2_EXP-I2C-IRQ (R45.1 U16.3), obc-v2_MCU-PinOut (U26.133)
MCU_I2C1_EXP_SDA: obc-v2_EXP-I2C-IRQ (R47.1 U16.2), obc-v2_MCU-PinOut (U26.134)
MCU_I2C2_RTC_SCL: obc-v2_RTC-WDOG (R13.1 U8.4), obc-v2_MCU-PinOut (U26.66)
MCU_I2C2_RTC_SDA: obc-v2_RTC-WDOG (R12.1 U8.5), obc-v2_MCU-PinOut (U26.67)
MCU_I2C4_CM4_SCL: obc-v2_CM4-IRQ-CTRL (R72.1 U27.6), obc-v2_MCU-PinOut (U26.53)
MCU_I2C4_CM4_SDA: obc-v2_CM4-IRQ-CTRL (R74.1 U27.7), obc-v2_MCU-PinOut (U26.54)
MCU_IO_DEBUG_LED0: obc-v2_DEBUG (R24.2), obc-v2_MCU-PinOut (U26.76)
MCU_IO_DEBUG_LED1: obc-v2_DEBUG (R25.2), obc-v2_MCU-PinOut (U26.77)
MCU_IO_DEBUG_LED2: obc-v2_DEBUG (R26.2), obc-v2_MCU-PinOut (U26.84)
MCU_IO_DEBUG_LED3: obc-v2_DEBUG (R27.2), obc-v2_MCU-PinOut (U26.85)
MCU_IO_GLOBAL_EN_CM4: obc-v2_CM4-IRQ-CTRL (R80.1 U25.7), obc-v2_MCU-PinOut (U26.88)
MCU_IO_IRQ-CM4_D0: obc-v2_CM4-IRQ-CTRL (R78.1 U24.7), obc-v2_MCU-PinOut (U26.61)
MCU_IO_IRQ-CM4_D1: obc-v2_CM4-IRQ-CTRL (R76.1 U24.6), obc-v2_MCU-PinOut (U26.60)
MCU_IO_IRQ-EXP_D0: obc-v2_EXP-I2C-IRQ (R40.1 U15.3), obc-v2_MCU-PinOut (U26.64)
MCU_IO_IRQ-EXP_D1: obc-v2_EXP-I2C-IRQ (R42.1 U15.2), obc-v2_MCU-PinOut (U26.63)
MCU_IO_RESET_CM4: obc-v2_CM4-IRQ-CTRL (R79.1 U25.6), obc-v2_MCU-PinOut (U26.87)
MCU_IO_RTC_CLKOUT: obc-v2_RTC-WDOG (R11.1 U8.3), obc-v2_MCU-PinOut (U26.47)
MCU_IO_RTC_INT: obc-v2_RTC-WDOG (R10.1 U8.7), obc-v2_MCU-PinOut (U26.48)
MCU_~{RST}: obc-v2_RTC-WDOG (C64.1 R16.1 R17.1 TP3.1), obc-v2_DEBUG (J6.8 J7.3), obc-v2_MCU-POWER (U26.27)
MCU_SPI5_CM4_CS: obc-v2_CM4-SPI-UART (U22.12), obc-v2_MCU-PinOut (U26.20)
MCU_SPI5_CM4_MISO: obc-v2_CM4-SPI-UART (U22.11), obc-v2_MCU-PinOut (U26.22)
MCU_SPI5_CM4_MOSI: obc-v2_CM4-SPI-UART (R54.1 U22.13), obc-v2_MCU-PinOut (U26.23)
MCU_SPI5_CM4_SCK: obc-v2_CM4-SPI-UART (U22.14), obc-v2_MCU-PinOut (U26.21)
MCU_SPI6_DEBUG_CS: obc-v2_EXP-CAN-RS422 (R49.1 U17.3), obc-v2_MCU-PinOut (U26.43)
MCU_SPI6_DEBUG_MISO: obc-v2_EXP-CAN-RS422 (R53.1 U17.6), obc-v2_MCU-PinOut (U26.45)
MCU_SPI6_DEBUG_MOSI: obc-v2_EXP-CAN-RS422 (U17.4), obc-v2_MCU-PinOut (U26.46)
MCU_SPI6_DEBUG_SCK: obc-v2_EXP-CAN-RS422 (U17.5), obc-v2_MCU-PinOut (U26.44)
MCU_UART-ISO_UART7_RX: obc-v2_EXP-CAN-RS422 (U18.2), obc-v2_MCU-PinOut (U26.57)
MCU_UART-ISO_UART7_TX: obc-v2_EXP-CAN-RS422 (U18.3), obc-v2_MCU-PinOut (U26.58)
MCU_USART1_DEBUG_RX: obc-v2_DEBUG (J8.3), obc-v2_MCU-PinOut (U26.99)
MCU_USART1_DEBUG_TX: obc-v2_DEBUG (J8.2), obc-v2_MCU-PinOut (U26.98)
MCU_USART2_CM4_RX: obc-v2_CM4-SPI-UART (U23.6), obc-v2_MCU-PinOut (U26.40)
MCU_USART2_CM4_TX: obc-v2_CM4-SPI-UART (U23.7), obc-v2_MCU-PinOut (U26.39)
MCU_USART6_DEBUG_RX: obc-v2_DEBUG (J10.3), obc-v2_MCU-PinOut (U26.122)
MCU_USART6_DEBUG_TX: obc-v2_DEBUG (J10.2), obc-v2_MCU-PinOut (U26.127)
MCU_WD_DONE: obc-v2_RTC-WDOG (U9.4), obc-v2_MCU-PinOut (U26.121)
MCU_WD_WAKE: obc-v2_RTC-WDOG (U9.5), obc-v2_MCU-PinOut (U26.9)
NetJ3_4: obc-v2_BOARD-CONNECT (J3.4), obc-v2_EXP-I2C-IRQ (R46.1 U16.6)
NetJ3_8: obc-v2_BOARD-CONNECT (J3.8), obc-v2_EXP-I2C-IRQ (R43.1 U15.7)
NetJ3_25: obc-v2_BOARD-CONNECT (J3.25), obc-v2_EXP-I2C-IRQ (R48.1 U16.7)
NetJ3_29: obc-v2_BOARD-CONNECT (J3.29), obc-v2_EXP-I2C-IRQ (R41.1 U15.6)
SPI-ISO_CONN_CS: obc-v2_BOARD-CONNECT (J3.7), obc-v2_EXP-CAN-RS422 (U17.14)
SPI-ISO_CONN_MISO: obc-v2_BOARD-CONNECT (J3.28), obc-v2_EXP-CAN-RS422 (U17.11)
SPI-ISO_CONN_MOSI: obc-v2_BOARD-CONNECT (J3.27), obc-v2_EXP-CAN-RS422 (U17.13)
SPI-ISO_CONN_SCK: obc-v2_BOARD-CONNECT (J3.6), obc-v2_EXP-CAN-RS422 (U17.12)
UART-ISO_CONN_RX: obc-v2_BOARD-CONNECT (J3.5), obc-v2_EXP-CAN-RS422 (U18.6)
UART-ISO_CONN_TX: obc-v2_BOARD-CONNECT (J3.26), obc-v2_EXP-CAN-RS422 (U18.7)